# Altium project Template.PrjPCB
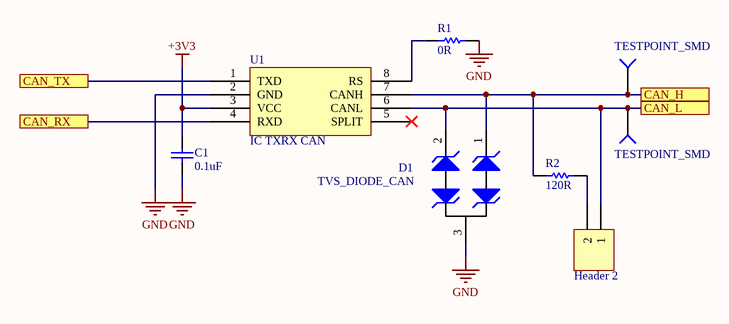
[diagram p0: CAN.SchDoc]
1 sheet, 8 parts. Net scope: flat (ports and power ports of the same name join across sheets).
Board file: Template.PcbDoc

## Sheet CAN.SchDoc
size A4

### Parts
1  Header 2  [HDR1X2]
C1  value 0.1uF  [CAPC0603(1608)55_N]  (hidden comment: CAP_0.1uF_16V_0603)
D1  TVS_DIODE_CAN  [TVS_DIODE_CAN]
R1  value 0R  [RESC0603(1608)_N]  (hidden comment: RES_0R_0603)
R2  value 120R  [RESC0603(1608)_N]  (hidden comment: RES_120R_0603)
TP1  TESTPOINT_SMD  [TESTPOINT]
TP2  TESTPOINT_SMD  [TESTPOINT]
U1  IC TXRX CAN  [LTC2875]

### Ports
CAN_H, CAN_L, CAN_RX, CAN_TX

### Nets
+3V3: C1.2 U1.3(VCC)
GND: C1.1 D1.3 R1.2 U1.2(GND)
Net1_1: 1.1 D1.2 TP2.1(=value) U1.6(CANL) ; port CAN_L
Net1_2: 1.2 R2.2
NetD1_1: D1.1 R2.1 TP1.1(=value) U1.7(CANH) ; port CAN_H
NetR1_1: R1.1 U1.8(RS)
NetU1_1: U1.1(TXD) ; port CAN_TX
NetU1_4: U1.4(RXD) ; port CAN_RX

Not connected (* = marked no-connect by the designer): U1 5(SPLIT)*

### Library data of the parts
1 = Header 2: Header, 2-Pin; LatestRevisionDate: 17-Jul-2002; LatestRevisionNote: Re-released for DXP Platform.; Publisher: Altium Limited
C1 = CAP_0.1uF_16V_0603: CAP CER 0.1UF 16V X7R 0603; Part Number: CC0603KRX7R7BB104; Manufacturer: Yageo; Dimensions: 0.063" L x 0.031" W (1.60mm x 0.80mm); Package: 0603 (1608 Metric); Temperature Coefficient: X7R; Voltage Rating: 16V
D1 = TVS_DIODE_CAN: TVS DIODE 24V 41V SOT323-3; Part Number: PESD2CAN,215; Manufacturer: Nexperia USA Inc.; Package: SC-70, SOT-323; ComponentLink1Description: Datasheet; ComponentLink1URL: https://assets.nexperia.com/documents/data-sheet/PESD1CAN-U.pdf
R1 = RES_0R_0603: RES SMD 0 OHM JUMPER 1/10W 0603; Manufacturer: Yageo; Part Number (MPN): RC0603JR-070RL; Package: 0603 (1608 Metric); Dimensions: 0.063" L x 0.031" W (1.60mm x 0.80mm)
R2 = RES_120R_0603: RES SMD 120 OHM 5% 1/10W 0603; Manufacturer: Yageo; Part Number (MPN): RC0603JR-07120RL; Package: 0603 (1608 Metric); Dimensions: 0.063" L x 0.031" W (1.60mm x 0.80mm); Tolerance: 5%
U1 = LTC2875: IC TXRX CAN 4MBPS 8SO; Manufacturer: Linear Technologies; Part Number: LTC2875IS8#PBF; Package: 8-SOIC (0.154", 3.90mm Width); ComponentLink1Description: Datasheet; ComponentLink1URL: https://www.analog.com/media/en/technical-documentation/data-sheets/2875f.pdf